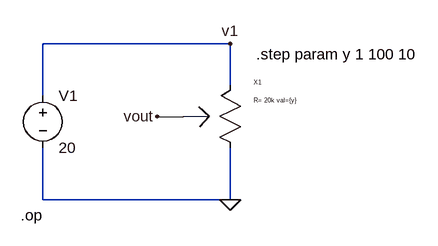
[diagram p0: schematic potentiometer.asc]
potentiometer.asc, the LTspice schematic file:
Version 4
SHEET 1 880 680
WIRE 256 80 -32 80
WIRE 256 144 256 80
WIRE -32 160 -32 80
WIRE -32 320 -32 240
WIRE 256 320 256 240
WIRE 256 320 -32 320
FLAG 256 320 0
FLAG 256 80 v1
FLAG 144 192 vout
SYMBOL pot 240 144 R0
WINDOW 39 52 23 Left 0
SYMATTR InstName X1
SYMATTR SpiceLine R= 20k val={y}
SYMBOL voltage -32 144 R0
WINDOW 123 0 0 Left 0
WINDOW 39 0 0 Left 0
SYMATTR InstName V1
SYMATTR Value 20
TEXT -66 344 Left 2 !.op
TEXT 296 96 Left 2 !.step param y 1 100 10

The netlist it stands for:
* potentiometer.asc
XX1 v1 vout 0 pot R= 20k val={y}  ; pins 1 2 3
V1 v1 0 20
.op
.step param y 1 100 10
.backanno
.end